# EAGLE design hdmi_receiver (EAGLE 5.05)

## Sheet 1 of 2
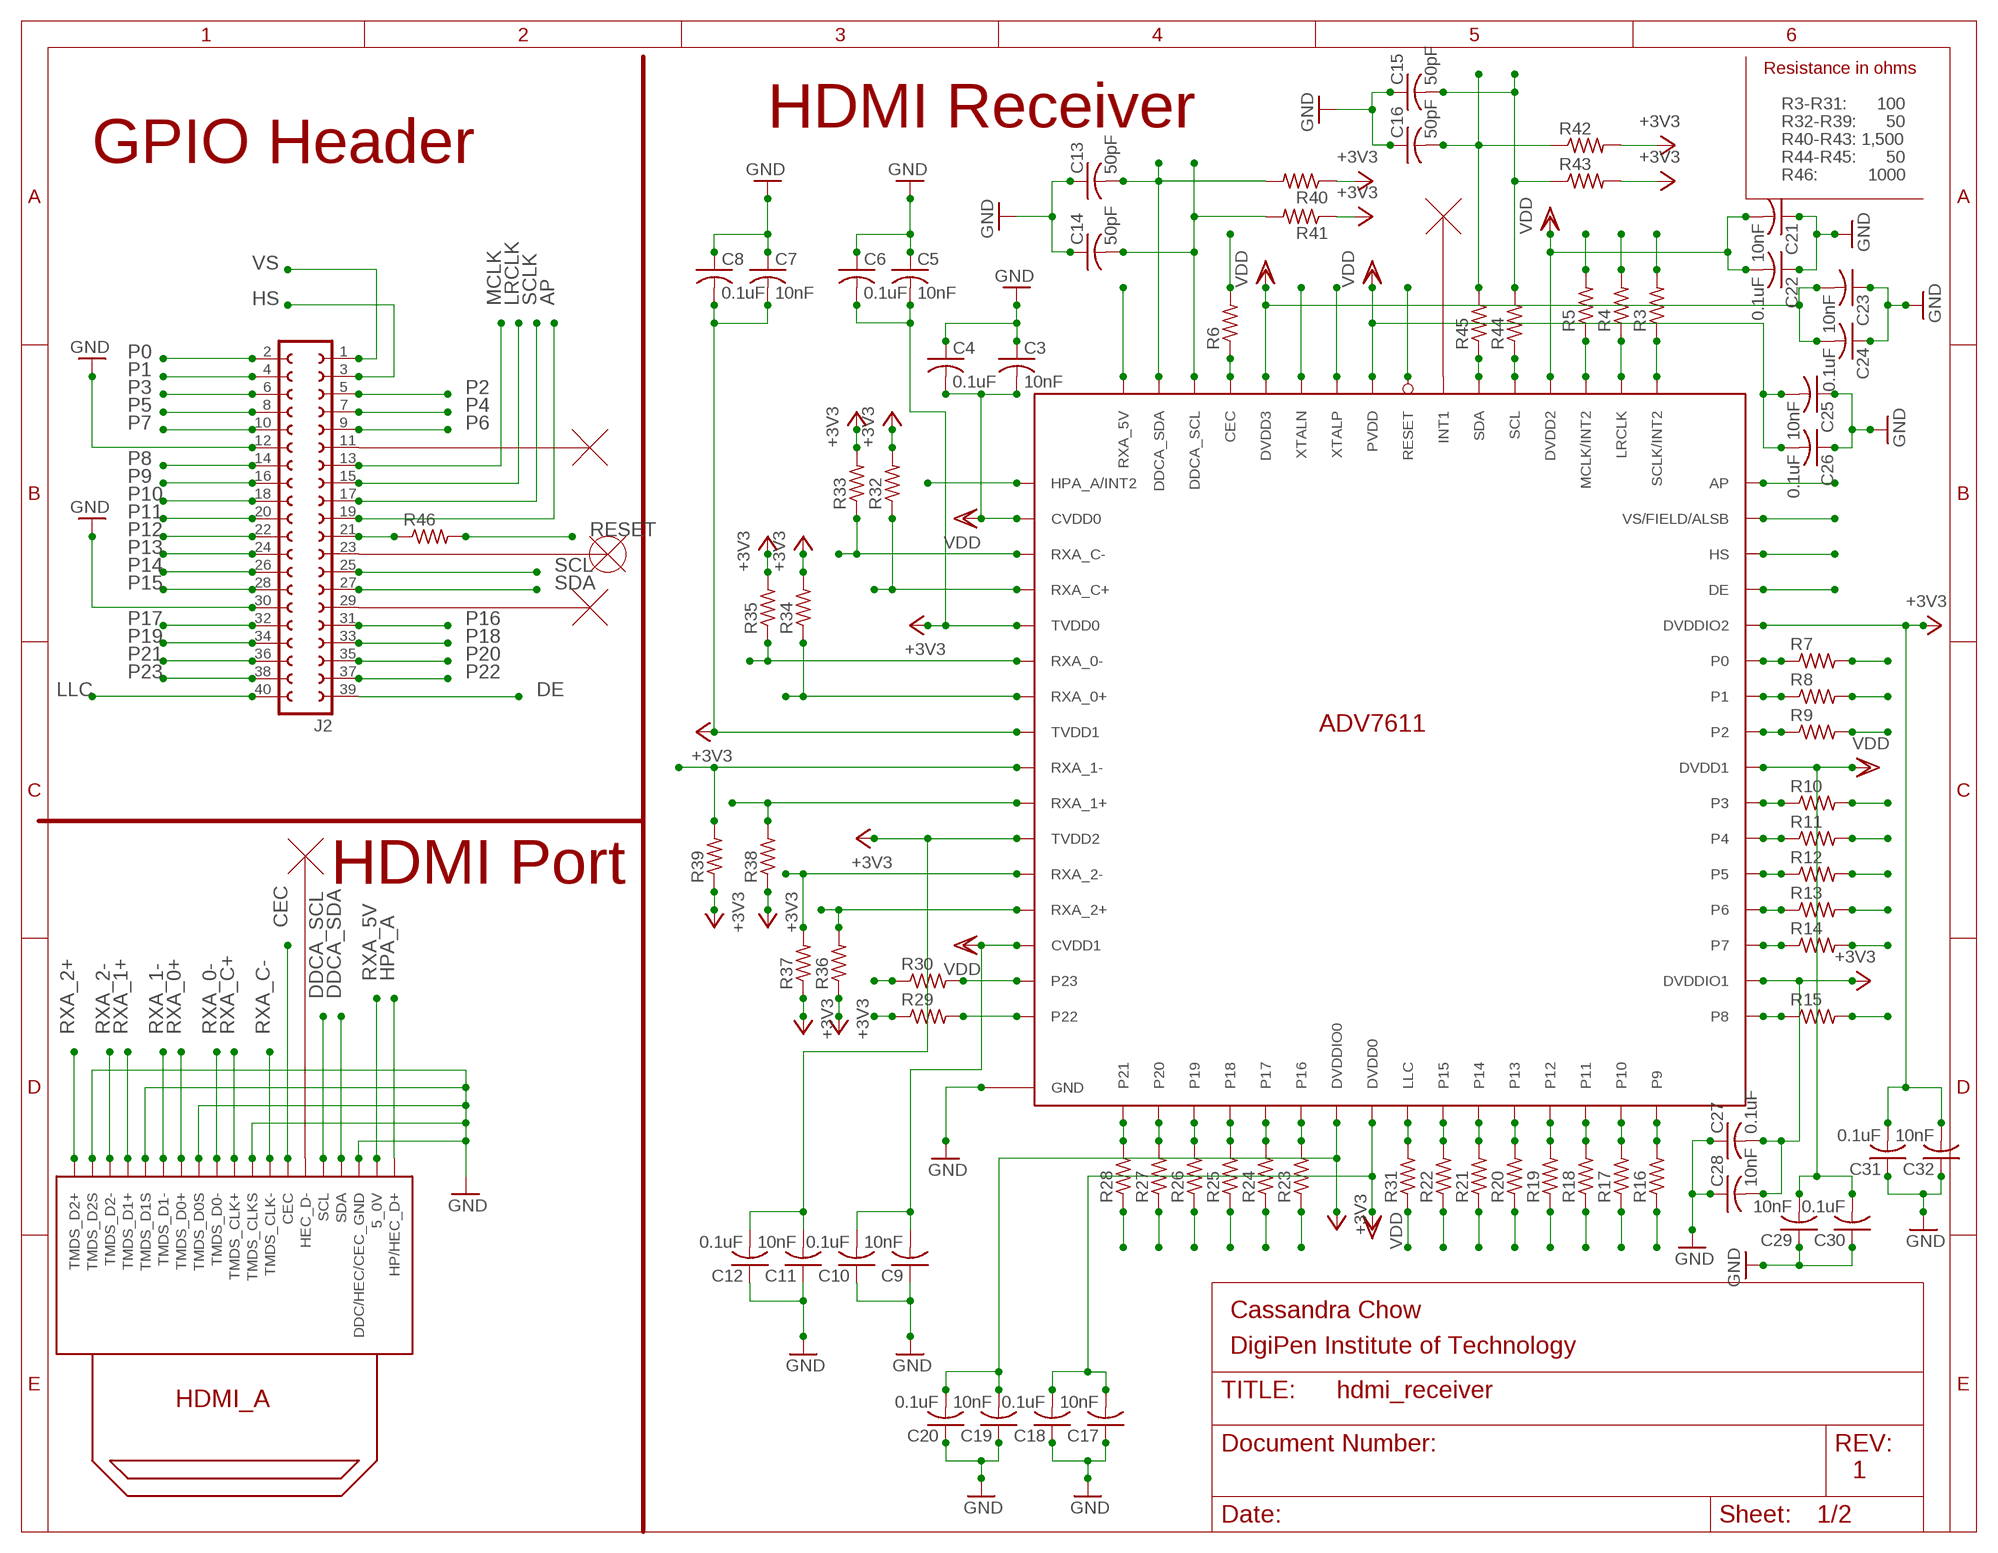
[diagram p0: schematic, sheet 1]

### Parts
ADV7611  ADV7611  [LQFP-ST-64-2]
C3  10nF  C-USC0603  [C0603]
C4  0.1uF  C-USC0603  [C0603]
C5  10nF  C-USC0603  [C0603]
C6  0.1uF  C-USC0603  [C0603]
C7  10nF  C-USC0603  [C0603]
C8  0.1uF  C-USC0603  [C0603]
C9  10nF  C-USC0603  [C0603]
C10  0.1uF  C-USC0603  [C0603]
C11  10nF  C-USC0603  [C0603]
C12  0.1uF  C-USC0603  [C0603]
C13  50pF  C-USC0603  [C0603]
C14  50pF  C-USC0603  [C0603]
C15  50pF  C-USC0603  [C0603]
C16  50pF  C-USC0603  [C0603]
C17  10nF  C-USC0603  [C0603]
C18  0.1uF  C-USC0603  [C0603]
C19  10nF  C-USC0603  [C0603]
C20  0.1uF  C-USC0603  [C0603]
C21  10nF  C-USC0603  [C0603]
C22  0.1uF  C-USC0603  [C0603]
C23  10nF  C-USC0603  [C0603]
C24  0.1uF  C-USC0603  [C0603]
C25  10nF  C-USC0603  [C0603]
C26  0.1uF  C-USC0603  [C0603]
C27  0.1uF  C-USC0603  [C0603]
C28  10nF  C-USC0603  [C0603]
C29  10nF  C-USC0603  [C0603]
C30  0.1uF  C-USC0603  [C0603]
C31  0.1uF  C-USC0603  [C0603]
C32  10nF  C-USC0603  [C0603]
J2  FE20-2  [FE20-2]
R3  R-US_R0603  [R0603]
R4  R-US_R0603  [R0603]
R5  R-US_R0603  [R0603]
R6  R-US_R0603  [R0603]
R7  R-US_R0603  [R0603]
R8  R-US_R0603  [R0603]
R9  R-US_R0603  [R0603]
R10  R-US_R0603  [R0603]
R11  R-US_R0603  [R0603]
R12  R-US_R0603  [R0603]
R13  R-US_R0603  [R0603]
R14  R-US_R0603  [R0603]
R15  R-US_R0603  [R0603]
R16  R-US_R0603  [R0603]
R17  R-US_R0603  [R0603]
R18  R-US_R0603  [R0603]
R19  R-US_R0603  [R0603]
R20  R-US_R0603  [R0603]
R21  R-US_R0603  [R0603]
R22  R-US_R0603  [R0603]
R23  R-US_R0603  [R0603]
R24  R-US_R0603  [R0603]
R25  R-US_R0603  [R0603]
R26  R-US_R0603  [R0603]
R27  R-US_R0603  [R0603]
R28  R-US_R0603  [R0603]
R29  R-US_R0603  [R0603]
R30  R-US_R0603  [R0603]
R31  R-US_R0603  [R0603]
R32  R-US_R0603  [R0603]
R33  R-US_R0603  [R0603]
R34  R-US_R0603  [R0603]
R35  R-US_R0603  [R0603]
R36  R-US_R0603  [R0603]
R37  R-US_R0603  [R0603]
R38  R-US_R0603  [R0603]
R39  R-US_R0603  [R0603]
R40  R-US_R0603  [R0603]
R41  R-US_R0603  [R0603]
R42  R-US_R0603  [R0603]
R43  R-US_R0603  [R0603]
R44  R-US_R0603  [R0603]
R45  R-US_R0603  [R0603]
R46  R-US_R0603  [R0603]
U$1  111RLF  [111RLF]

### Nets
+3V3: ADV7611.5(TVDD0) ADV7611.8(TVDD1) ADV7611.11(TVDD2) ADV7611.23(DVDDIO0) ADV7611.34(DVDDIO1) ADV7611.44(DVDDIO2) C5.2 C6.2 C7.2 C8.2 C11.2 C12.2 C19.2 C20.2 C27.2 C28.2 C31.2 C32.2 R32.2 R33.2 R34.2 R35.2 R36.1 R37.1 R38.1 R39.1 R40.1 R41.1 R42.2 R43.2 ; also sheet 2
AP: ADV7611.48(AP) J2.19
CEC: R6.2 U$1.13(CEC)
DDCA_SCL: ADV7611.62(DDCA_SCL) C14.2 R41.2 U$1.15(SCL)
DDCA_SDA: ADV7611.63(DDCA_SDA) C13.2 R40.2 U$1.16(SDA)
DE: ADV7611.45(DE) J2.39
GND: ADV7611.0(GND) C3.1 C4.1 C5.1 C6.1 C7.1 C8.1 C9.1 C10.1 C11.1 C12.1 C13.1 C14.1 C15.1 C16.1 C17.1 C18.1 C19.1 C20.1 C21.1 C22.1 C23.1 C24.1 C25.1 C26.1 C27.1 C28.1 C29.1 C30.1 C31.1 C32.1 J2.12 J2.30 U$1.2(TMDS_D2S) U$1.5(TMDS_D1S) U$1.8(TMDS_D0S) U$1.11(TMDS_CLKS) U$1.17(DDC/HEC/CEC_GND) ; also sheet 2
HPA_A: ADV7611.1(HPA_A/INT2) U$1.19(HP/HEC_D+)
HS: ADV7611.46(HS) J2.3
LLC: J2.40 R31.1
LRCLK: J2.15 R4.2
MCLK: J2.13 R5.2
N$1: ADV7611.25(LLC) R31.2
N$4: ADV7611.49(SCLK/INT2) R3.1
N$5: ADV7611.50(LRCLK) R4.1
N$6: ADV7611.51(MCLK/INT2) R5.1
N$7: ADV7611.61(CEC) R6.1
N$8: ADV7611.39(P3) R10.1
N$9: ADV7611.38(P4) R11.1
N$10: ADV7611.37(P5) R12.1
N$11: ADV7611.36(P6) R13.1
N$12: ADV7611.35(P7) R14.1
N$14: ADV7611.54(SDA) R45.1
N$15: ADV7611.53(SCL) R44.1
N$16: J2.21 R46.1
N$18: ADV7611.32(P9) R16.2
N$19: ADV7611.31(P10) R17.2
N$20: ADV7611.30(P11) R18.2
N$21: ADV7611.29(P12) R19.2
N$22: ADV7611.28(P13) R20.2
N$23: ADV7611.27(P14) R21.2
N$24: ADV7611.26(P15) R22.2
N$25: ADV7611.22(P16) R23.2
N$26: ADV7611.21(P17) R24.2
N$27: ADV7611.20(P18) R25.2
N$28: ADV7611.19 R26.2
N$29: ADV7611.18(P20) R27.2
N$30: ADV7611.17(P21) R28.2
N$44: ADV7611.16(P22) R29.2
N$45: ADV7611.15(P23) R30.2
N$48: ADV7611.33(P8) R15.1
N$49: ADV7611.41(P2) R9.1
N$51: ADV7611.42(P1) R8.1
N$52: ADV7611.43(P0) R7.1
P0: J2.2 R7.2
P1: J2.4 R8.2
P2: J2.5 R9.2
P3: J2.6 R10.2
P4: J2.7 R11.2
P5: J2.8 R12.2
P6: J2.9 R13.2
P7: J2.10 R14.2
P8: J2.14 R15.2
P9: J2.16 R16.1
P10: J2.18 R17.1
P11: J2.20 R18.1
P12: J2.22 R19.1
P13: J2.24 R20.1
P14: J2.26 R21.1
P15: J2.28 R22.1
P16: J2.31 R23.1
P17: J2.32 R24.1
P18: J2.33 R25.1
P19: J2.34 R26.1
P20: J2.35 R27.1
P21: J2.36 R28.1
P22: J2.37 R29.1
P23: J2.38 R30.1
RESET: ADV7611.56(RESET) R46.2 ; also sheet 2
RXA_0+: ADV7611.7(RXA_0+) R34.1 U$1.7(TMDS_D0+)
RXA_0-: ADV7611.6(RXA_0-) R35.1 U$1.9(TMDS_D0-)
RXA_1+: ADV7611.10(RXA_1+) R38.2 U$1.4(TMDS_D1+)
RXA_1-: ADV7611.9(RXA_1-) R39.2 U$1.6(TMDS_D1-)
RXA_2+: ADV7611.13(RXA_2+) R36.2 U$1.1(TMDS_D2+)
RXA_2-: ADV7611.12(RXA_2-) R37.2 U$1.3(TMDS_D2-)
RXA_5V: ADV7611.64(RXA_5V) U$1.18(5_0V)
RXA_C+: ADV7611.4(RXA_C+) R32.1 U$1.10(TMDS_CLK+)
RXA_C-: ADV7611.3(RXA_C-) R33.1 U$1.12(TMDS_CLK-)
SCL: C15.2 J2.25 R43.1 R44.2
SCLK: J2.17 R3.2
SDA: C16.2 J2.27 R42.1 R45.2
VDD: ADV7611.2(CVDD0) ADV7611.14(CVDD1) ADV7611.24(DVDD0) ADV7611.40(DVDD1) ADV7611.52(DVDD2) ADV7611.57(PVDD) ADV7611.60(DVDD3) C3.2 C4.2 C9.2 C10.2 C17.2 C18.2 C21.2 C22.2 C23.2 C24.2 C25.2 C26.2 C29.2 C30.2 ; also sheet 2
VS: ADV7611.47(VS/FIELD/ALSB) J2.1
XTALN: ADV7611.59(XTALN) ; also sheet 2
XTALP: ADV7611.58(XTALP) ; also sheet 2
Unconnected: ADV7611.55(INT1) J2.11 J2.23 J2.29 U$1.14(HEC_D-)

### Notes on the sheet
- Resistance in ohms
- R3-R31:      100
- HDMI Receiver | R32-R39:      50
- R40-R43: 1,500
- GPIO Header | R44-R45:      50
- R46:          1000
- VS
- HS | MCLK | LRCLK | SCLK | AP
- P0
- P1
- P3 | P2
- P5 | P4
- P7 | P6
- P8
- P9
- P10
- P11
- P12 | RESET
- P13
- P14 | SCL
- P15 | SDA
- P17 | P16
- P19 | P18
- P21 | P20
- P23 | P22
- LLC | DE
- HDMI Port
- CEC
- RXA_5V | HPA_A
- DDCA_SCL | DDCA_SDA
- RXA_2+ | RXA_2- | RXA_1+ | RXA_1- | RXA_0+ | RXA_0- | RXA_C+ | RXA_C-
- Cassandra Chow
- DigiPen Institute of Technology
- 1

## Sheet 2 of 2
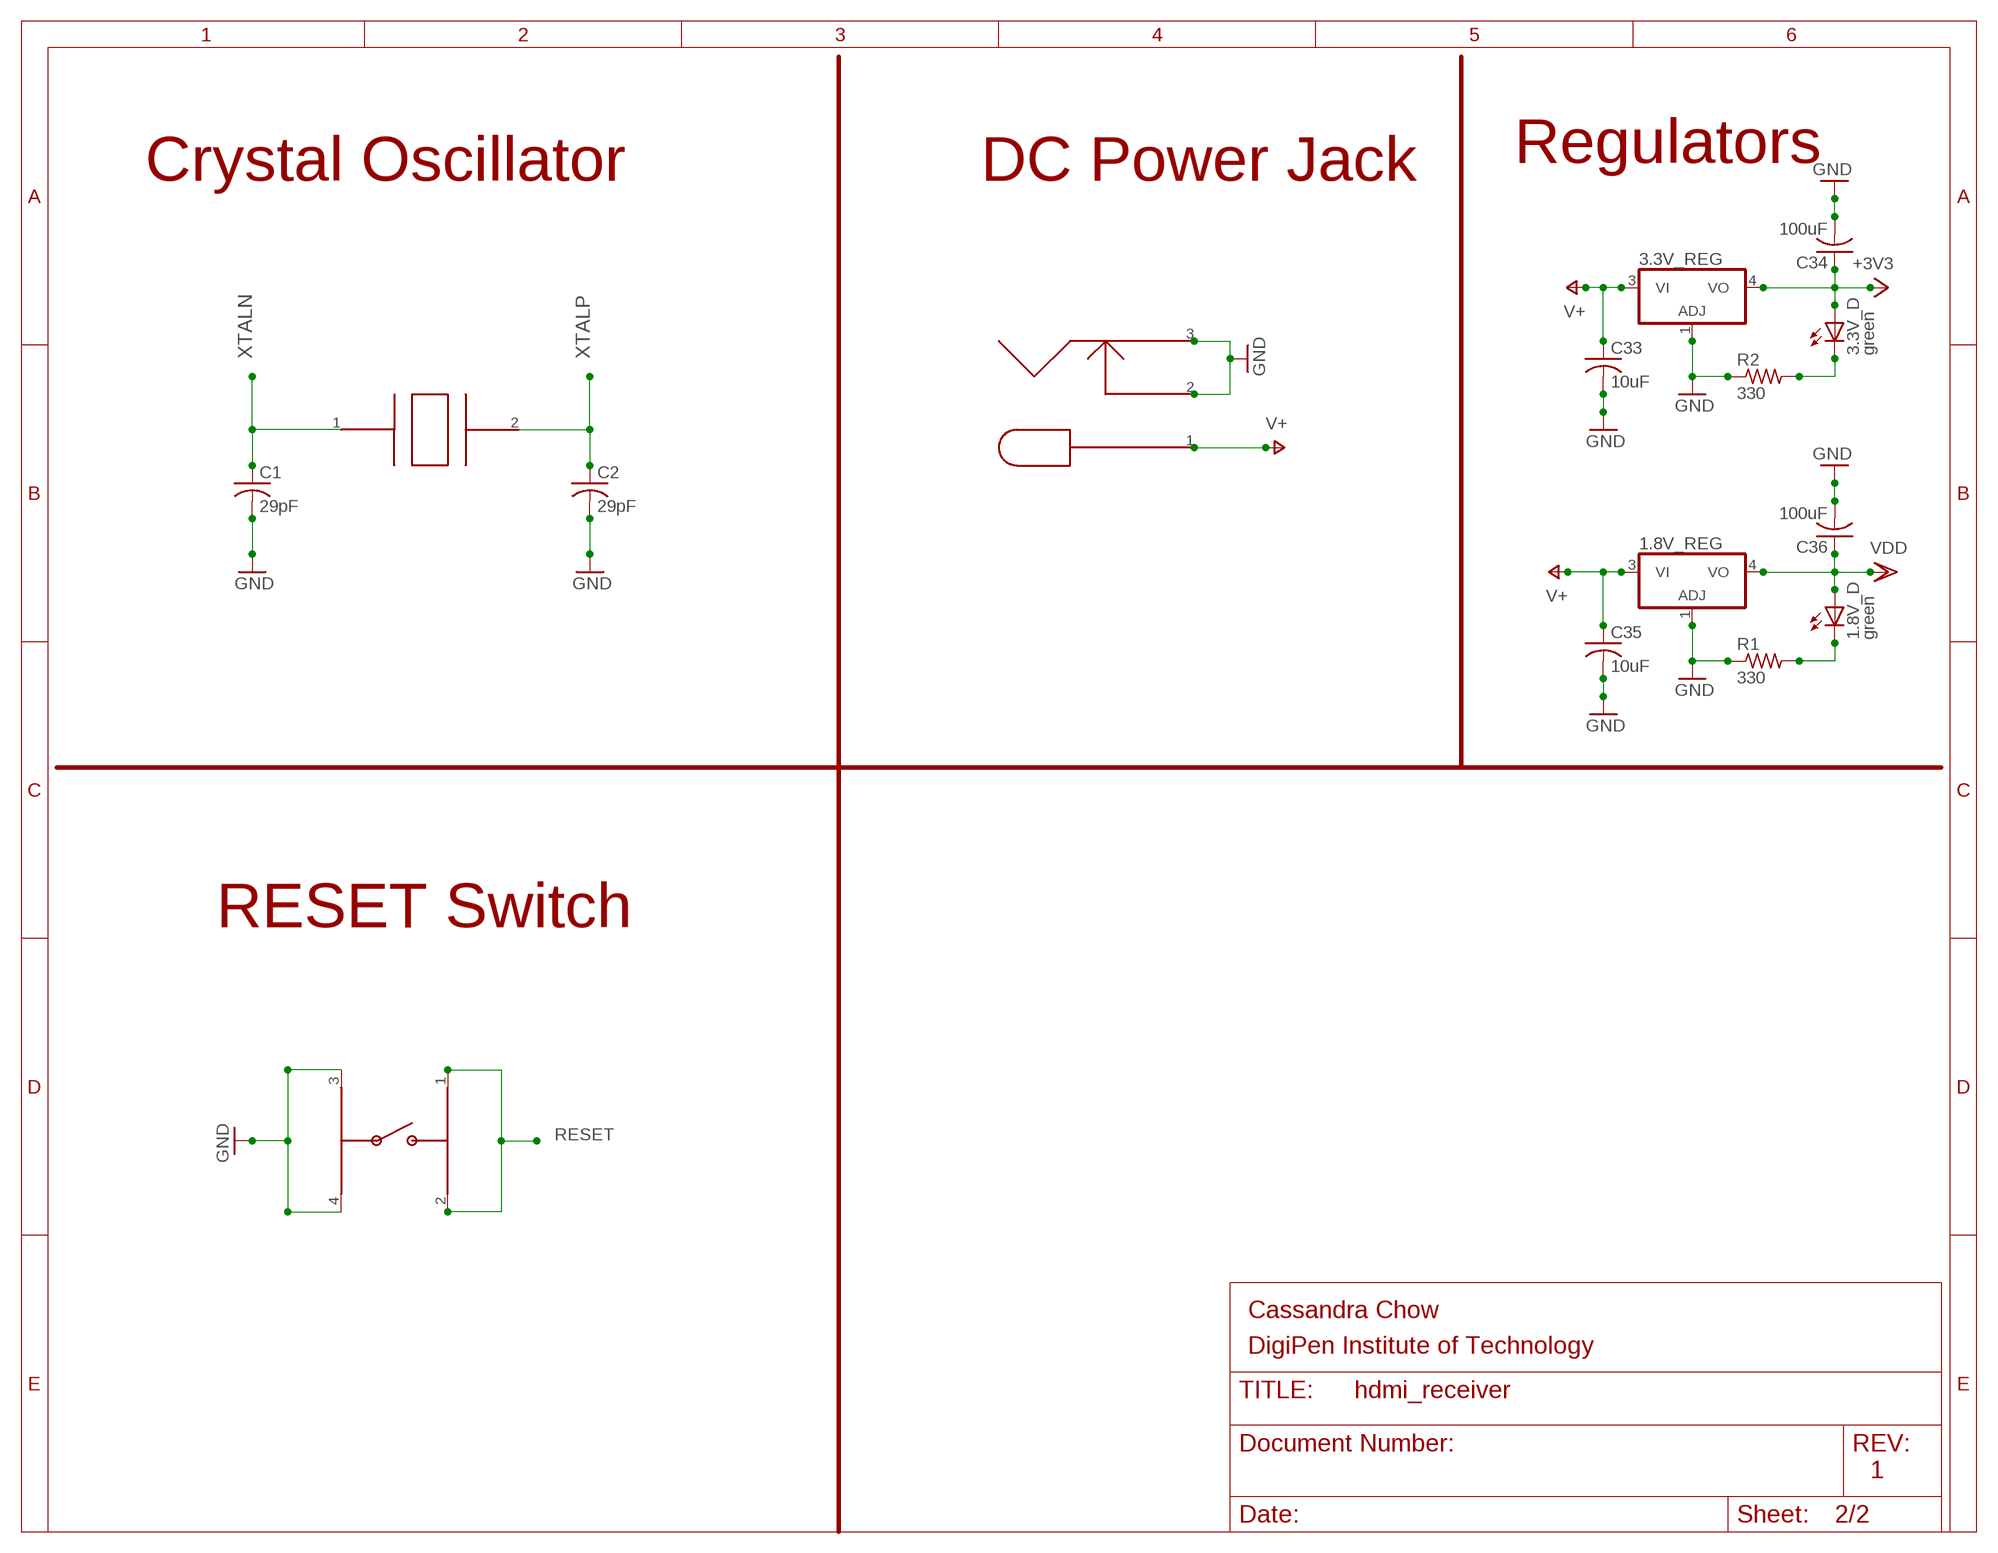
[diagram p1: schematic, sheet 2]

### Parts
1.8V_D  green  LED5MM  [LED5MM]
1.8V_REG  317EMP  [SOT223]
3.3V_D  green  LED5MM  [LED5MM]
3.3V_REG  317EMP  [SOT223]
C1  29pF  C-USC1210  [C1210]
C2  29pF  C-USC1210  [C1210]
C33  10uF  C-USC0603  [C0603]
C34  100uF  C-USC1206  [C1206]
C35  10uF  C-USC0603  [C0603]
C36  100uF  C-USC1206  [C1206]
R1  330  R-US_R0603  [R0603]
R2  330  R-US_R0603  [R0603]
U$2  CRYSTAL_OSC  [CRYSTAL_OSC]
U$3  CK_SWITCH  [CK_SWITCH]
U$4  DC_BARREL_CONN  [DC_BARREL_CONN]

### Nets
+3V3: 3.3V_D.A 3.3V_REG.4(VO) C34.1 ; also sheet 1
GND: 1.8V_REG.1(ADJ) 3.3V_REG.1(ADJ) C1.2 C2.2 C33.2 C34.2 C35.2 C36.2 R1.1 R2.1 U$3.3 U$3.4 U$4.2 U$4.3 ; also sheet 1
N$2: 1.8V_D.K(C) R1.2
N$3: 3.3V_D.K(C) R2.2
RESET: U$3.1 U$3.2 ; also sheet 1
V+: 1.8V_REG.3(VI) 3.3V_REG.3(VI) C33.1 C35.1 U$4.1
VDD: 1.8V_D.A 1.8V_REG.4(VO) C36.1 ; also sheet 1
XTALN: C1.1 U$2.1 ; also sheet 1
XTALP: C2.1 U$2.2 ; also sheet 1

### Notes on the sheet
- Crystal Oscillator | DC Power Jack | Regulators
- XTALN | XTALP
- RESET Switch
- RESET
- Cassandra Chow
- DigiPen Institute of Technology
- 1

## Library data of the parts
1.8V_D 3.3V_D = led:LED: LED OSRAM: - CHIPLED LG R971, LG N971, LY N971, LG Q971, LY Q971, LO R971, LY R971 LH N974, LH R974 LS Q976, LO Q976, LY Q976 LO Q996 - Hyper CHIPLED LW Q18S LB Q993, LB Q99A, LB R99A - SideLED LS A670, LO A670, LY A670, LG A670, LP A670 LB A673, LV A673, LT A673, LW A673 LH A674 LY A675 LS A676, LA A676, LO A676, LY A676, LW A676 LS A679, LY A679, LG A679 - Hyper Micro SIDELED® LS Y876, LA Y876, LO Y876, LY Y876 LT Y87S - SmartLED LW L88C, LW L88S LB L89C, LB L89S, LG L890 LS L89K, LO L89K, LY L89K LS L896, LA L896, LO L896, LY L896 - TOPLED LS T670, LO T670, LY T670, LG T670, LP T670 LSG T670, LSP T670, LSY T670, LOP T670, LYG T670 LG T671, LOG T671, LSG T671 LB T673, LV T673, LT T673, LW T673 LH T674 LS T676, LA T676, LO T676, LY T676, LB T676, LH T676, LSB T676, LW T676 LB T67C, LV T67C, LT T67C, LS T67K, LO T67K, LY T67K, LW E67C LS E67B, LA E67B, LO E67B, LY E67B, LB E67C, LV E67C, LT E67C LW T67C LS T679, LY T679, LG T679 LS T770, LO T770, LY T770, LG T770, LP T770 LB T773, LV T773, LT T773, LW T773 LH T774 LS E675, LA E675, LY E675, LS T675 LS T776, LA T776, LO T776, LY T776, LB T776 LHGB T686 LT T68C, LB T68C - Hyper Mini TOPLED® LB M676 - Mini TOPLED Santana® LG M470 LS M47K, LO M47K, LY M47K Source: http://www.osram.convergy.de LUXEON: - LUMILED® LXK2-PW12-R00, LXK2-PW12-S00, LXK2-PW14-U00, LXK2-PW14-V00 LXK2-PM12-R00, LXK2-PM12-S00, LXK2-PM14-U00 LXK2-PE12-Q00, LXK2-PE12-R00, LXK2-PE12-S00, LXK2-PE14-T00, LXK2-PE14-U00 LXK2-PB12-K00, LXK2-PB12-L00, LXK2-PB12-M00, LXK2-PB14-N00, LXK2-PB14-P00, LXK2-PB14-Q00 LXK2-PR12-L00, LXK2-PR12-M00, LXK2-PR14-Q00, LXK2-PR14-R00 LXK2-PD12-Q00, LXK2-PD12-R00, LXK2-PD12-S00 LXK2-PH12-R00, LXK2-PH12-S00 LXK2-PL12-P00, LXK2-PL12-Q00, LXK2-PL12-R00 Source: www.luxeon.com KINGBRIGHT: KA-3528ASYC Source: www.kingbright.com
1.8V_REG 3.3V_REG = linear:*317: Positive VOLTAGE REGULATOR
ADV7611 = cchow_2014:ADV7611
C1-C36 = rcl:C-US: CAPACITOR, American symbol
J2 = con-lsta:FE20-2: FEMALE HEADER
R1-R46 = resistor:R-US_: RESISTOR, American symbol
U$1 = cchow_2014:111RLF
U$2 = cchow_2014:CRYSTAL_OSC
U$3 = cchow_2014:CK_SWITCH
U$4 = cchow_2014:DC_BARREL_CONN

## Board
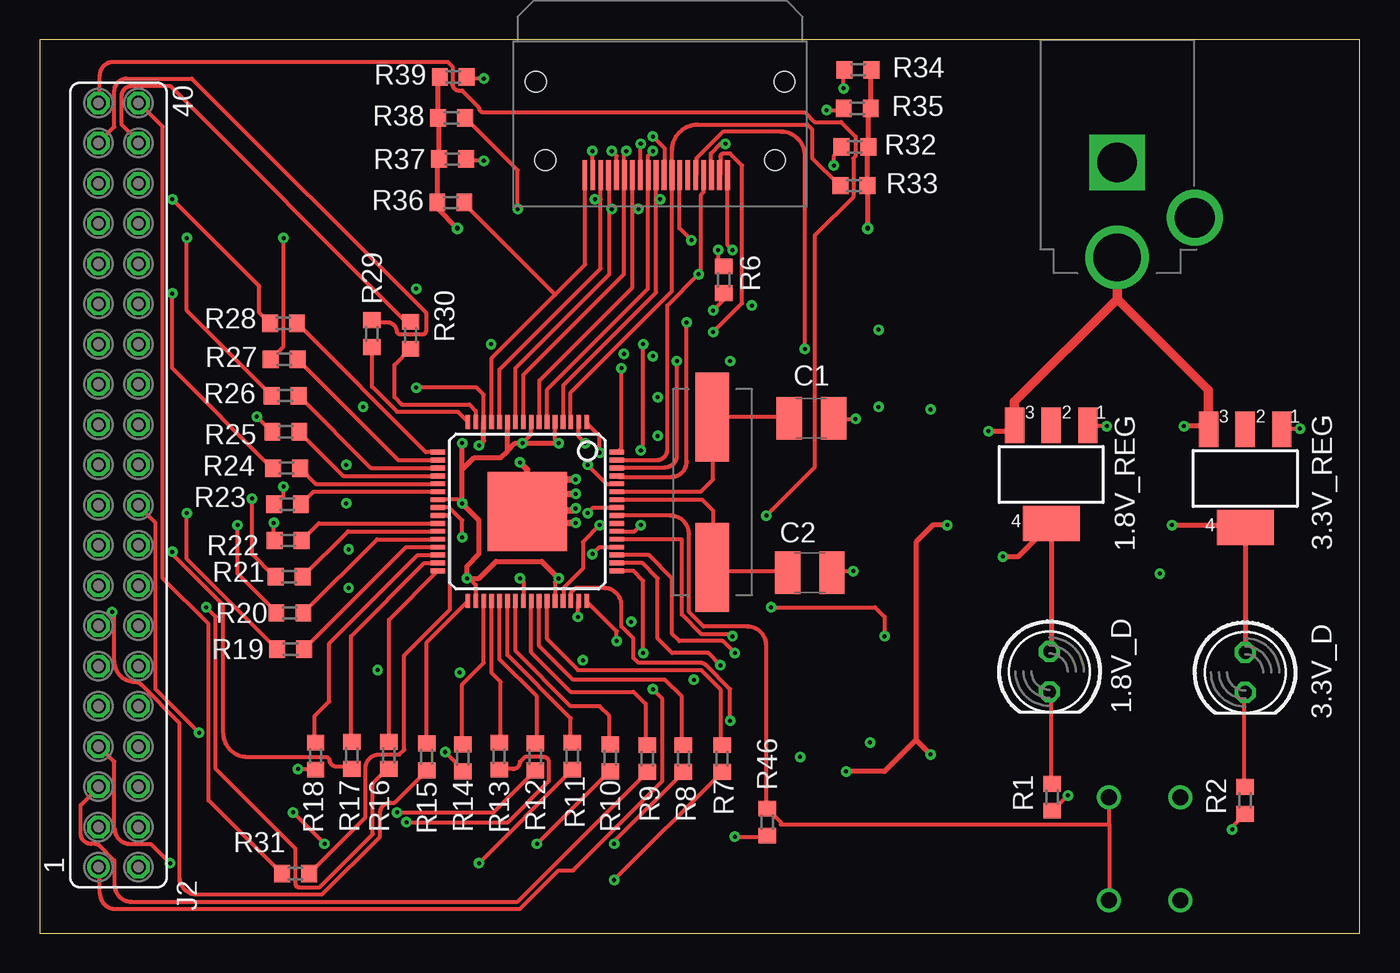
[diagram p2: board, top side]
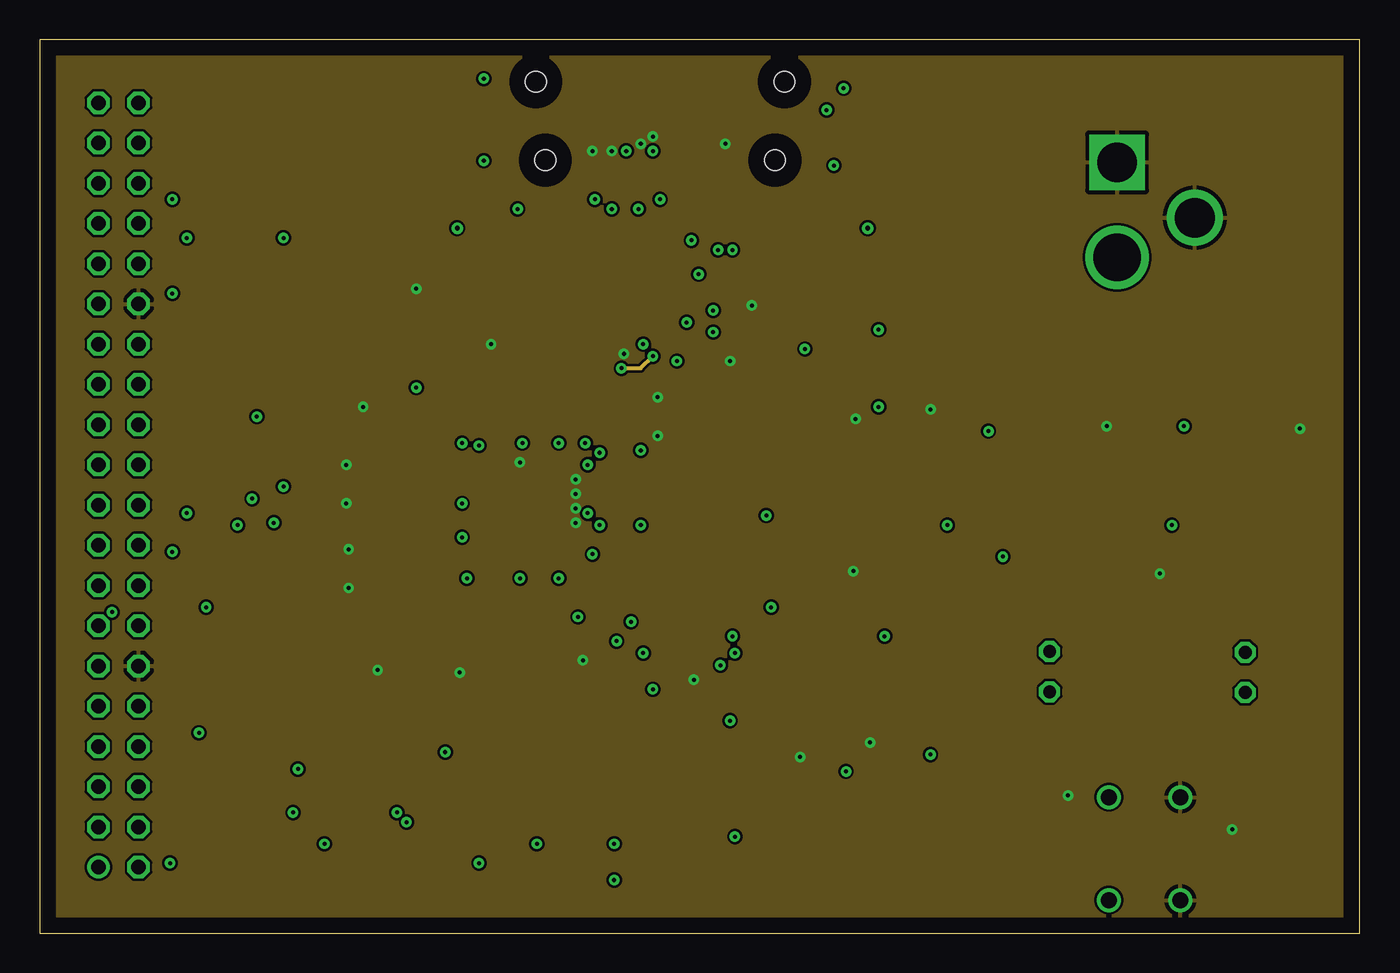
[diagram p3: board, inner layer Route2]
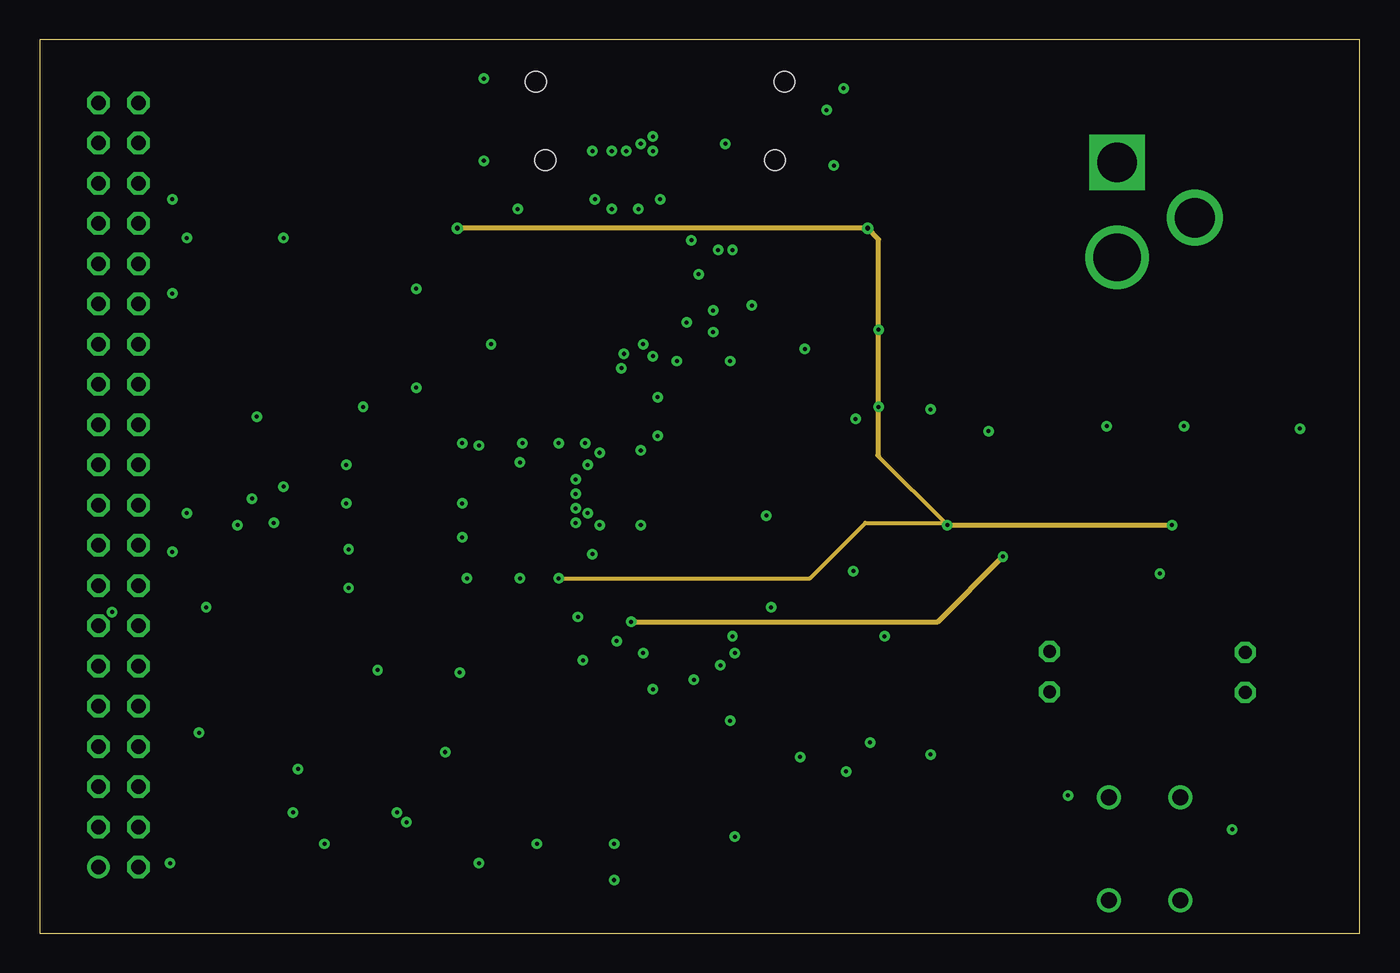
[diagram p4: board, inner layer Route3]
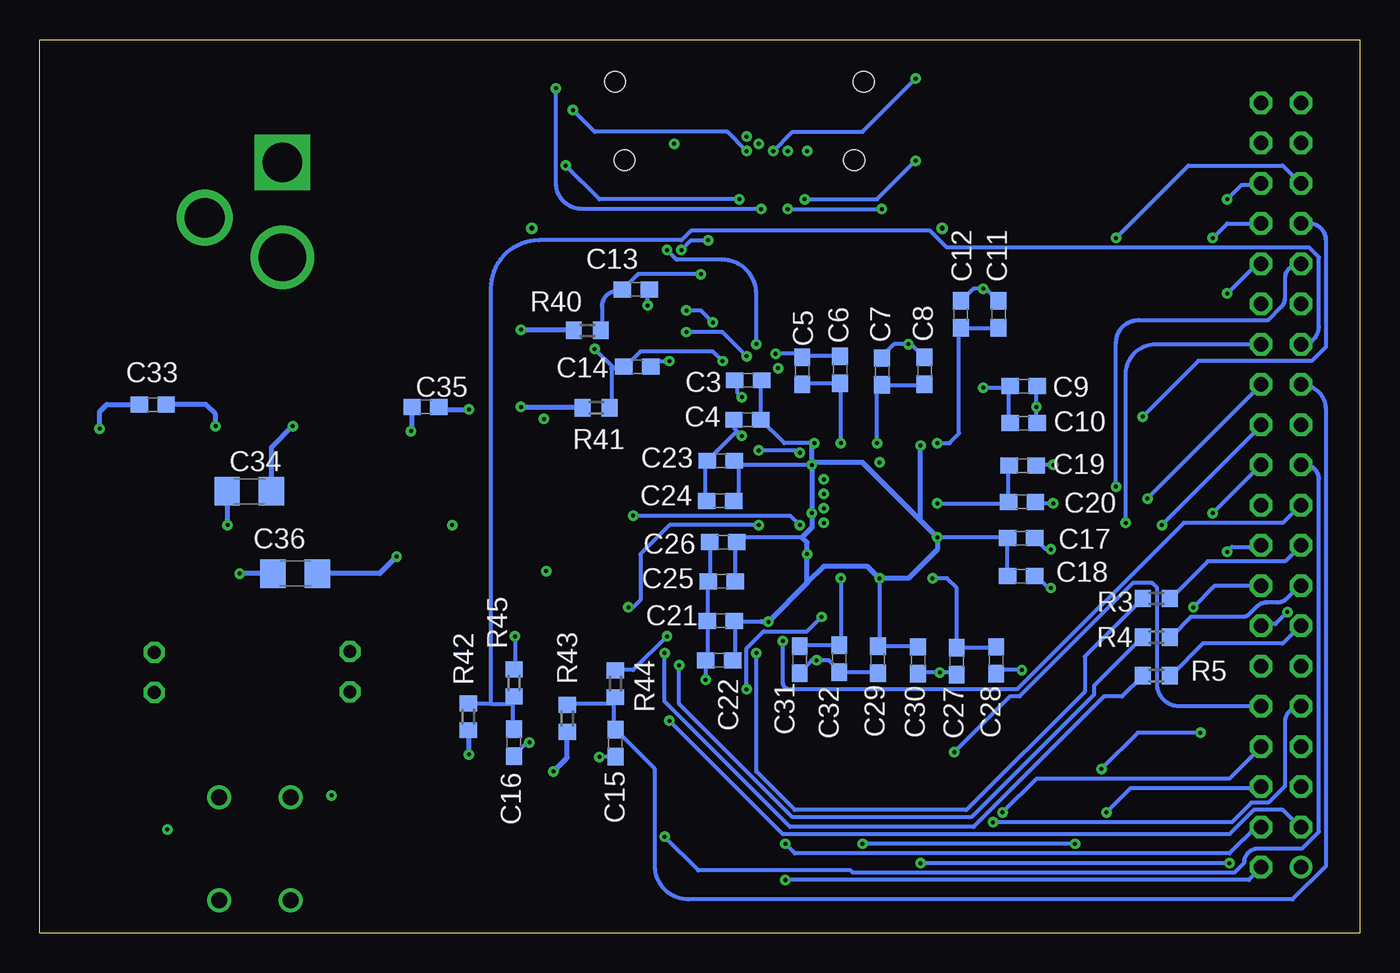
[diagram p5: board, bottom side, seen from below]

Size 83.34 x 56.41 mm. Coordinates in mm from the lower left corner, seen from the top.
Outline: 0,0 83.34,0 83.34,56.41 0,56.41 0,0
Copper layers (1*2*3*16): Top 0.035mm / dielectric 0.2286mm / Route2 0.035mm / dielectric 0.9906mm / Route3 0.035mm / dielectric 0.2286mm / Bottom 0.035mm
Design rules "default *": minimum track width 10mil, minimum drill 10mil, track to track 6mil, track to pad 6mil, pad to pad 6mil, via to via 6mil, smd to smd 6mil, copper to edge 40mil, drill to drill 10mil, minimum pad ring 10mil, minimum via ring 8mil, stop-mask expansion 4mil, vias tented up to drill 0mil, thermal gap 10mil
vRestrict: area 39.6,20.1 to 45.4,35.7

### Footprints (pad centres in the part's own frame; a part is rotated, then mirrored left to right if it is on the bottom)
LED5MM = drill 0.813 octagon: A -1.27,0; K 1.27,0
SOT223 = smd 1.219 x 2.235: 1 -2.311,-3.099; 2 0,-3.099; 3 2.311,-3.099 | smd 3.6 x 2.2: 4 0,3.099
LQFP-ST-64-2 = smd 5 x 5: 0 0,0 | smd 0.9 x 0.3: 1 -5.65,3.75; 2 -5.65,3.25; 3 -5.65,2.75; 4 -5.65,2.25; 5 -5.65,1.75; 6 -5.65,1.25; 7 -5.65,0.75; 8 -5.65,0.25; 9 -5.65,-0.25; 10 -5.65,-0.75; 11 -5.65,-1.25; 12 -5.65,-1.75; 13 -5.65,-2.25; 14 -5.65,-2.75; 15 -5.65,-3.25; 16 -5.65,-3.75; 33 5.65,-3.75; 34 5.65,-3.25; 35 5.65,-2.75; 36 5.65,-2.25; 37 5.65,-1.75; 38 5.65,-1.25; 39 5.65,-0.75; 40 5.65,-0.25; 41 5.65,0.25; 42 5.65,0.75; 43 5.65,1.25; 44 5.65,1.75; 45 5.65,2.25; 46 5.65,2.75; 47 5.65,3.25; 48 5.65,3.75 | smd 0.3 x 0.9: 17 -3.75,-5.65; 18 -3.25,-5.65; 19 -2.75,-5.65; 20 -2.25,-5.65; 21 -1.75,-5.65; 22 -1.25,-5.65; 23 -0.75,-5.65; 24 -0.25,-5.65; 25 0.25,-5.65; 26 0.75,-5.65; 27 1.25,-5.65; 28 1.75,-5.65; 29 2.25,-5.65; 30 2.75,-5.65; 31 3.25,-5.65; 32 3.75,-5.65; 49 3.75,5.65; 50 3.25,5.65; 51 2.75,5.65; 52 2.25,5.65; 53 1.75,5.65; 54 1.25,5.65; 55 0.75,5.65; 56 0.25,5.65; 57 -0.25,5.65; 58 -0.75,5.65; 59 -1.25,5.65; 60 -1.75,5.65; 61 -2.25,5.65; 62 -2.75,5.65; 63 -3.25,5.65; 64 -3.75,5.65
C1210 = smd 1.6 x 2.7: 1 -1.4,0; 2 1.4,0
C0603 = smd 1.1 x 1: 1 -0.85,0; 2 0.85,0
C1206 = smd 1.6 x 1.8: 1 -1.4,0; 2 1.4,0
FE20-2 = drill 0.914 round: 1 -24.13,1.27 | drill 0.914 octagon: 2 -24.13,-1.27; 3 -21.59,1.27; 4 -21.59,-1.27; 5 -19.05,1.27; 6 -19.05,-1.27; 7 -16.51,1.27; 8 -16.51,-1.27; 9 -13.97,1.27; 10 -13.97,-1.27; 11 -11.43,1.27; 12 -11.43,-1.27; 13 -8.89,1.27; 14 -8.89,-1.27; 15 -6.35,1.27; 16 -6.35,-1.27; 17 -3.81,1.27; 18 -3.81,-1.27; 19 -1.27,1.27; 20 -1.27,-1.27; 21 1.27,1.27; 22 1.27,-1.27; 23 3.81,1.27; 24 3.81,-1.27; 25 6.35,1.27; 26 6.35,-1.27; 27 8.89,1.27; 28 8.89,-1.27; 29 11.43,1.27; 30 11.43,-1.27; 31 13.97,1.27; 32 13.97,-1.27; 33 16.51,1.27; 34 16.51,-1.27; 35 19.05,1.27; 36 19.05,-1.27; 37 21.59,1.27; 38 21.59,-1.27; 39 24.13,1.27; 40 24.13,-1.27
R0603 = smd 1 x 1.1: 1 -0.85,0; 2 0.85,0
111RLF = smd 0.3 x 1.9: 1 4.75,0; 2 4.25,0; 3 3.75,0; 4 3.25,0; 5 2.75,0; 6 2.25,0; 7 1.75,0; 8 1.25,0; 9 0.75,0; 10 0.25,0; 11 -0.25,0; 12 -0.75,0; 13 -1.25,0; 14 -1.75,0; 15 -2.25,0; 16 -2.75,0; 17 -3.25,0; 18 -3.75,0; 19 -4.25,0 | hole 1.3: -7.25,-0.95; 7.25,-0.95; -7.85,-5.9; 7.85,-5.9
CRYSTAL_OSC = smd 5.6 x 2.1: 1 -4.75,0; 2 4.75,0
CK_SWITCH = drill 1 round: 1 -3.25,2.25; 2 3.25,2.25; 3 -3.25,-2.25; 4 3.25,-2.25
DC_BARREL_CONN = drill 3 round: 1 6,0 | drill 2.5 round: 2 3.5,4.9 | drill 2.5 square: 3 0,0

### Placement (x,y rotation side)
1.8V_D  63.75,16.51 270 top
1.8V_REG  63.86,28.96 180 top
3.3V_D  76.1,16.46 270 top
3.3V_REG  76.1,28.7 180 top
ADV7611  30.78,26.62 270 top
C1  48.72,32.51 0 top
C2  48.62,22.76 0 top
C3  38.61,34.9 0 bottom
C4  38.66,32.41 0 bottom
C5  35.2,35.51 270 bottom
C6  32.82,35.56 270 bottom
C7  30.18,35.46 270 bottom
C8  27.48,35.51 270 bottom
C9  21.23,34.54 180 bottom
C10  21.23,32.21 180 bottom
C11  22.81,39.07 270 bottom
C12  25.2,39.07 270 bottom
C13  45.72,40.64 180 bottom
C14  45.62,35.76 180 bottom
C15  46.99,11.99 90 bottom
C16  53.39,12.04 90 bottom
C17  21.39,24.94 180 bottom
C18  21.39,22.56 180 bottom
C19  21.29,29.51 180 bottom
C20  21.34,27.23 180 bottom
C21  40.34,19.71 0 bottom
C22  40.44,17.22 0 bottom
C23  40.34,29.82 0 bottom
C24  40.39,27.28 0 bottom
C25  40.28,22.2 0 bottom
C26  40.18,24.69 0 bottom
C27  25.45,17.17 90 bottom
C28  22.96,17.22 90 bottom
C29  30.43,17.27 90 bottom
C30  27.89,17.22 90 bottom
C31  35.36,17.27 90 bottom
C32  32.87,17.32 90 bottom
C33  76.2,33.38 180 bottom
C34  70.1,27.89 0 bottom
C35  58.98,33.22 0 bottom
C36  67.21,22.71 180 bottom
J2  4.98,28.3 90 top
R1  63.91,8.59 90 top
R2  76.1,8.38 90 top
R3  12.85,21.13 0 bottom
R4  12.85,18.69 0 bottom
R5  12.85,16.26 0 bottom
R6  43.18,41.25 90 top
R7  43.08,11.02 270 top
R8  40.64,11.02 270 top
R9  38.35,11.02 270 top
R10  36.02,11.07 270 top
R11  33.63,11.18 270 top
R12  31.29,11.13 270 top
R13  29.01,11.18 270 top
R14  26.72,11.07 270 top
R15  24.43,11.13 270 top
R16  22.05,11.23 90 top
R17  19.71,11.23 90 top
R18  17.42,11.18 90 top
R19  15.85,17.93 0 top
R20  15.8,20.22 0 top
R21  15.75,22.5 0 top
R22  15.7,24.79 0 top
R23  15.65,27.08 0 top
R24  15.6,29.36 0 top
R25  15.54,31.65 0 top
R26  15.49,33.93 0 top
R27  15.44,36.22 0 top
R28  15.39,38.51 0 top
R29  20.98,37.85 270 top
R30  23.42,37.74 270 top
R31  16.15,3.76 0 top
R32  51.46,49.63 0 top
R33  51.41,47.19 0 top
R34  51.66,54.51 0 top
R35  51.61,52.07 0 top
R36  25.96,46.13 0 top
R37  26.06,48.87 0 top
R38  26.01,51.46 0 top
R39  26.11,54.05 0 top
R40  48.77,38.05 0 bottom
R41  48.21,33.17 0 bottom
R42  56.29,13.67 270 bottom
R43  50.04,13.56 270 bottom
R44  46.99,15.75 270 bottom
R45  53.39,15.8 270 bottom
R46  45.92,7.01 90 top
U$1  39.17,47.85 180 top
U$2  42.47,27.84 270 top
U$3  69.75,5.33 90 top
U$4  68.02,48.67 270 top

### Tracks (layer width: path | path; a pad name or v marks a point on that pad's centre or on a via)
+3V3  (via drill 0.25, 0.3)
  Top 0.254: ADV7611.5 32.53,31.17 v32.77,30.94 | ADV7611.8 31.04,31.49 v30.48,30.94 | v26.98,22.4 27.13,22.4 27.54,22 ADV7611.34 | v52.27,44.5 52.26,44.51 | ADV7611.44 32.53,22.17 v32.77,22.4 | ADV7611.23 26.43,27.37 v26.67,27.13
  Top 0.305: 3.3V_D.A 3.3V_REG.4 75.95,25.76 v71.48,25.76 | 27.13,22.4 27.74,22.4 28.8,23.47 31.7,23.47 v32.77,22.4 | v26.98,22.4 26.98,23.16 27.74,23.93 27.74,26.06 v26.67,27.13 26.67,29.26 | v32.77,30.94 v30.48,30.94 30.02,30.94 29.54,30.45 | v52.27,44.5 52.27,47.18 R33.2 52.26,49.58 R32.2 52.31,51.92 R35.2 52.46,54.46 R34.2 | v26.36,44.5 25.11,45.76 R36.1 25.11,48.77 R37.1 25.21,51.41 R38.1 25.16,53.95 R39.1 | v57.3,25.76 56.39,25.76 55.32,24.69 55.32,12.19 | 55.32,12.19 v56.24,11.28 | v50.9,10.21 53.34,10.21 55.32,12.19 | 26.67,29.26 v26.67,30.94 | 26.67,29.26 27.43,30.02 29.11,30.02 29.54,30.45 | 29.54,30.45 ADV7611.11
  Route3 0.254: 52.88,30.18 52.96,30.1 v57.3,25.76 57.15,25.91 52.12,25.91 48.62,22.4 v32.77,22.4
  Route3 0.305: v57.3,25.76 v71.48,25.76 | 52.96,30.1 v52.96,33.22 v52.96,38.1 52.96,43.81 v52.27,44.5 v26.36,44.5
  Bottom 0.254: C5.2 35.15,34.71 C6.2 32.77,34.66 v32.77,30.94 | v30.48,30.94 30.48,34.3 C7.2 27.53,34.61 C8.2 | C11.2 C12.2 25.3,38.11 25.3,31.55 25.91,30.94 v26.67,30.94 | v26.67,27.13 22.29,27.13 C20.2 22.19,29.46 C19.2 | v26.98,22.4 26.06,22.4 25.45,21.79 C27.2 23.01,18.02 C28.2 | C31.2 35.31,18.17 C32.2 32.77,18.27 v32.77,22.4
  Bottom 0.305: v56.24,11.28 56.24,12.76 R42.2 | R43.2 50.04,11.07 v50.9,10.21 | R40.1 49.67,38.1 v52.96,38.1 | R41.1 49.11,33.22 v52.96,33.22 | v71.48,25.76 71.48,27.86 C34.1
AP  (via drill 0.25)
  Top 0.254: v36.42,18.44 36.42,19.05 34.59,20.88 ADV7611.48
  Bottom 0.254: v36.42,18.44 36.42,15.82 arc-90 35.99,15.39 21.64,15.39 11.12,25.91 4.88,25.91 3.81,26.98 J2.19
CEC  (via drill 0.25)
  Top 0.254: v42.82,43.13 42.82,42.52 43.13,42.22 R6.2 | v41.15,43.74 40.39,44.5 40.39,47.85 U$1.13
  Bottom 0.254: v42.82,43.13 42.22,43.74 v41.15,43.74
DDCA_SCL  (via drill 0.25)
  Top 0.254: v40.23,36.12 40.23,30.18 arc-90 39.47,29.41 36.58,29.41 ADV7611.62 | v48.31,36.88 48.31,49.09 arc90 46.8,50.6 43.13,50.6 41.45,48.92 41.45,47.85 U$1.15
  Bottom 0.254: v40.23,36.12 40.84,36.73 45.41,36.73 46.33,35.81 C14.2 46.48,35.66 47.09,35.66 | 47.09,35.66 47.24,35.66 47.24,33.22 R41.2 | 47.09,35.66 v48.31,36.88
DDCA_SDA  (via drill 0.25)
  Top 0.254: ADV7611.63 36.58,29.87 38.98,29.87 arc90 39.62,30.52 39.62,39.62 v41.6,41.6 41.76,41.76 41.76,46.63 41.91,46.79 U$1.16
  Bottom 0.254: R40.2 47.85,38.1 47.85,39.56 arc90 46.88,40.54 46.63,40.54 C13.2 46.48,40.69 45.57,41.6 v41.6,41.6
DE  (via drill 0.25)
  Top 0.254: v35.36,25.76 34.29,24.69 34.29,23.01 33.07,21.79 33.07,21.03 ADV7611.45 | v45.87,26.36 48.92,29.41 48.92,44.04 51.36,46.48 51.36,48.92 51.51,49.07 51.51,50.29 50.6,51.21 48.92,51.21 48.31,51.82 28.04,51.82 arc-90 27.74,52.12 26.67,53.19 26.49,53.19 arc-90 26.06,53.62 26.06,54.71 25.76,55.02 4.67,55.02 arc90 3.81,54.15 3.81,52.43 J2.39
  Bottom 0.254: v35.36,25.76 35.97,26.36 v45.87,26.36
GND  (via drill 0.25)
  Top 0.254: v64.92,8.69 64.01,7.77 R1.1 | v75.29,6.55 75.29,6.71 76.05,7.47 R2.1 | v34.9,49.38 34.9,47.85 U$1.2 | v36.12,49.38 36.42,49.07 U$1.5 | v37.95,49.84 37.95,47.85 U$1.8 | v38.71,50.29 39.47,49.53 39.47,47.85 U$1.11 | v43.28,49.84 42.98,49.84 42.37,49.23 42.37,47.85 U$1.17 | v67.36,32 66.29,32 1.8V_REG.1 | v79.55,31.85 78.49,31.85 3.3V_REG.1 | v51.36,22.86 50.14,22.86 C2.2 | v51.51,32.46 50.14,32.46 C1.2
  Top 0.406: v30.33,29.72 30.79,29.26 30.79,26.67 | ADV7611.0 30.79,26.67 | v33.83,28.65 32.77,28.65 30.79,26.67 | 30.79,26.67 31.85,27.74 v33.83,27.74 | v33.83,26.82 33.68,26.67 30.79,26.67 | v33.83,25.91 31.55,25.91 30.79,26.67
  Bottom 0.254: C26.1 41,24.69 41,22.25 C25.1 41.15,22.1 41.15,19.81 C21.1 41.15,19.66 41.15,17.22 C22.1 v41.3,16 | C29.1 30.48,16.46 32.77,16.46 C32.1 32.92,16.61 33.53,17.22 v34.29,17.22 34.59,17.22 35.36,16.46 C31.1 | v19.51,21.79 19.66,21.79 20.42,22.55 C18.1 | v19.51,24.23 19.81,24.23 20.42,24.84 C17.1 | v19.36,27.13 20.42,27.13 C20.1 | v19.36,29.57 20.42,29.57 C19.1 | C10.1 20.42,32.31 v20.42,33.22 20.42,34.44 C9.1 | v21.34,16.61 22.71,16.61 22.86,16.46 C28.1 | C27.1 25.45,16.46 v26.52,16.46 27.89,16.46 C30.1 | C4.1 39.47,32.31 39.47,31.85 v39.01,31.39 39.32,31.55 39.47,31.55 41.15,29.87 C23.1 41.3,29.72 41.3,27.28 C24.1 | C11.1 22.86,39.93 23.62,40.69 v23.77,40.69 24.38,40.69 25.15,39.93 C12.1 | v39.01,33.83 39.32,34.14 39.32,34.9 C3.1 | v43.59,36.12 44.35,36.12 44.65,35.81 C14.1 | C8.1 27.58,36.42 28.35,37.19 v28.5,37.19 29.41,37.19 30.18,36.42 C7.1 | 35.2,36.42 35.36,36.58 v36.88,36.58 | 35.2,36.42 32.92,36.42 C6.1 | 35.2,36.42 C5.1 | v44.96,39.62 44.96,40.54 C13.1 | v48.01,11.12 47.09,11.12 C15.1 | v52.43,12.04 52.58,12.04 53.34,11.28 C16.1
  Bottom 0.305: v56.24,33.07 57.98,33.07 C35.2 | C36.2 v70.71,22.71 | C34.2 68.7,30.66 v67.36,32 | C33.2 79.1,33.38 79.55,32.92 v79.55,31.85
  pour Route2: 0,56.39 87.17,56.39 87.17,0 0,0
HPA_A  (via drill 0.25)
  Top 0.254: v35.36,30.33 35.36,31.39 34.59,32.16 ADV7611.1 | v37.95,30.48 38.1,30.63 v38.1,37.19 | v43.74,43.13 43.43,43.43 43.43,47.85 U$1.19
  Bottom 0.254: v35.36,30.33 35.51,30.48 v37.95,30.48 | v38.1,37.19 38.1,40.35 arc-90 40.27,42.52 43.13,42.52 v43.74,43.13
HS  (via drill 0.25)
  Top 0.254: v43.59,13.41 43.59,15.39 42.05,16.93 arc45 41.71,17.07 37.8,17.07 37.49,17.37 37.49,18.59 36.73,19.36 36.73,20.69 arc90 35.63,21.79 33.83,21.79 33.53,21.49 33.53,21.03 ADV7611.46
  Bottom 0.254: v43.59,13.41 36.42,6.25 8.23,6.25 6.71,7.77 4.88,7.77 3.81,6.71 J2.3
LLC
  Top 0.254: J2.40 7.77,50.9 7.77,22.4 10.67,19.51 10.67,8.38 15.24,3.81 R31.1
LRCLK
  Bottom 0.254: R4.2 11.89,18.75 10.67,19.96 7.39,19.96 arc-45 7,20.12 6.53,20.6 arc45 5.85,20.88 5.16,20.88 arc-45 4.68,21.08 3.81,21.95 J2.15
MCLK
  Bottom 0.254: R5.2 11.89,16.31 9.91,18.29 4.88,18.29 3.81,19.36 J2.13
N$1
  Top 0.254: ADV7611.25 25.15,26.36 25.76,26.36 25.91,26.21 25.91,20.42 23.01,17.53 23.01,11.58 22.71,11.28 21.44,11.28 arc90 20.57,10.41 20.57,7.32 17.07,3.81 R31.2
N$2
  Top 0.254: R1.2 63.86,9.45 63.86,15.24 1.8V_D.K
N$3
  Top 0.254: R2.2 76.05,9.3 76.05,15.09 3.3V_D.K
N$4  (via drill 0.25)
  Top 0.254: ADV7611.49 37.48,22.87 38.1,22.25 v38.1,17.68
  Bottom 0.254: v38.1,17.68 38.1,10.21 35.66,7.77 24.84,7.77 17.37,15.24 17.37,17.46 R3.1
N$5  (via drill 0.25)
  Top 0.254: ADV7611.50 38.05,23.37 39.01,22.4 39.01,18.59 39.93,17.68 42.22,17.68 v42.98,16.92
  Bottom 0.254: v42.98,16.92 42.98,14.48 35.81,7.32 24.54,7.32 16.76,15.09 16.76,15.63 R4.1
N$6  (via drill 0.25)
  Top 0.254: ADV7611.51 38.46,23.87 39.93,22.4 39.93,18.9 40.39,18.44 43.13,18.44 v43.89,17.68
  Bottom 0.254: v43.89,17.68 43.89,14.63 35.97,6.71 24.38,6.71 16.15,14.94 15.02,14.94 R5.1
N$7  (via drill 0.25)
  Top 0.254: v40.84,38.56 40.84,29.78 arc-90 39.87,28.8 36.58,28.8 ADV7611.61 | v42.52,39.32 43.13,39.93 43.13,40.39 R6.1
  Bottom 0.254: v40.84,38.56 41.6,39.32 v42.52,39.32
N$8
  Top 0.254: ADV7611.39 30.04,17.82 33.53,14.33 35.36,14.33 35.97,13.72 35.97,11.97 R10.1
N$9
  Top 0.254: ADV7611.38 29.54,17.56 33.53,13.56 33.53,12.13 R11.1
N$10
  Top 0.254: ADV7611.37 29.04,17.3 31.39,14.94 31.39,12.08 R12.1
N$11
  Top 0.254: ADV7611.36 28.54,16.42 29.11,15.85 29.11,12.13 R13.1
N$12
  Top 0.254: ADV7611.35 28.04,17.06 26.67,15.7 26.67,11.97 R14.1
N$14  (via drill 0.25)
  Top 0.254: ADV7611.54 37.56,25.37 v37.95,25.76 | v46.18,20.57 52.73,20.57 53.34,19.96 v53.34,18.75
  Bottom 0.254: v37.95,25.76 43.59,25.76 45.41,23.93 45.41,21.03 45.87,20.57 v46.18,20.57 | v53.34,18.75 53.34,16.7 R45.1
N$15  (via drill 0.25)
  Top 0.254: v43.74,18.75 43.74,18.9 41.76,18.9 40.54,20.12 40.54,24.84 36.58,24.84 ADV7611.53
  Bottom 0.254: v43.74,18.75 45.87,16.61 46.94,16.61 R44.1
N$16  (via drill 0.25)
  Top 0.254: v43.89,6.1 45.87,6.1 R46.1
  Bottom 0.254: v43.89,6.1 41.76,3.96 32.16,3.96 32,3.81 7.92,3.81 7.33,4.4 arc-45 7.32,4.45 arc90 6.43,5.33 3.66,5.33 2.59,6.4 2.59,28.68 arc-90 3.48,29.57 J2.21
N$18
  Top 0.254: ADV7611.32 22.05,19.78 R16.2
N$19
  Top 0.254: ADV7611.31 24.28,23.37 19.66,18.75 19.66,12.13 R17.2
N$20
  Top 0.254: ADV7611.30 23.87,23.87 18.29,18.29 18.29,14.63 17.37,13.72 17.37,12.08 R18.2
N$21
  Top 0.254: R19.2 23.14,24.37 ADV7611.29
N$22
  Top 0.254: R20.2 21.3,24.87 ADV7611.28
N$23
  Top 0.254: R21.2 19.46,25.37 ADV7611.27
N$24
  Top 0.254: R22.2 17.63,25.87 ADV7611.26
N$25
  Top 0.254: R23.2 17.29,27.87 ADV7611.22
N$26
  Top 0.254: R24.2 17.44,28.37 ADV7611.21
N$27
  Top 0.254: R25.2 19.17,28.87 ADV7611.20
N$28
  Top 0.254: R26.2 20.91,29.37 ADV7611.19
N$29
  Top 0.254: R27.2 22.64,29.87 ADV7611.18
N$30
  Top 0.254: R28.2 24.38,30.37 ADV7611.17
N$44
  Top 0.254: ADV7611.16 26.39,32.92 22.55,32.92 20.98,34.49 R29.2
N$45
  Top 0.254: R30.2 22.4,35.88 22.4,33.83 22.86,33.38 27.13,33.38 27.54,32.97 ADV7611.15
N$48
  Top 0.254: ADV7611.33 24.43,18.37 R15.1
N$49
  Top 0.254: ADV7611.41 31.04,17.73 33.53,15.24 37.49,15.24 38.25,14.48 38.25,11.97 R9.1
N$51
  Top 0.254: ADV7611.42 31.54,18.15 33.68,16 39.47,16 40.54,14.94 40.54,11.97 R8.1
N$52
  Top 0.254: ADV7611.43 32.03,18.56 33.98,16.61 41.76,16.61 42.98,15.39 42.98,11.97 R7.1
P0  (via drill 0.25)
  Top 0.254: v36.27,3.35 42.98,10.06 R7.2
  Bottom 0.254: v36.27,3.35 7.01,3.35 6.25,4.12 J2.2
P1  (via drill 0.25)
  Top 0.254: v36.27,5.64 36.27,5.79 40.54,10.06 R8.2
  Bottom 0.254: v36.27,5.64 35.66,5.03 8.23,5.03 6.55,6.71 J2.4
P2
  Top 0.254: R9.2 38.25,10.06 30.18,1.98 5.8,1.98 arc-90 4.72,3.06 4.72,4.57 3.76,5.54 arc45 3.52,5.64 3.24,5.64 arc-90 2.59,6.29 2.59,8.08 3.66,9.14 J2.5
P3  (via drill 0.25)
  Top 0.254: v31.39,5.64 35.97,10.21 R10.2 | v16,7.62 v17.98,5.64
  Bottom 0.254: v17.98,5.64 v31.39,5.64 | v16,7.62 14.48,9.14 6.25,9.14 J2.6
P4  (via drill 0.25)
  Top 0.254: v27.74,4.42 33.53,10.21 R11.2 | v8.23,4.42 7.01,5.64 5.7,5.64 arc-90 4.72,6.62 4.72,10.82 3.81,11.73 J2.7
  Bottom 0.254: v8.23,4.42 v27.74,4.42
P5  (via drill 0.25)
  Top 0.254: v22.55,7.62 28.65,7.62 31.24,10.21 R12.2
  Bottom 0.254: v22.55,7.62 20.42,9.75 8.23,9.75 6.25,11.73 J2.8
P6  (via drill 0.25)
  Top 0.254: v23.16,7.01 29.57,7.01 32.16,9.6 32.16,10.78 arc90 31.82,11.12 30.63,11.12 30.33,10.82 arc-90 29.87,10.36 29.11,10.36 R13.2
  Bottom 0.254: v23.16,7.01 8.08,7.01 6.86,8.23 5.79,8.23 4.72,9.3 4.72,13.31 arc90 J2.9
P7  (via drill 0.25)
  Top 0.254: v25.6,11.43 26.67,10.36 R14.2
  Bottom 0.254: v25.6,11.43 22.1,14.94 21.49,14.94 14.33,22.1 13.11,22.1 12.8,21.79 12.8,15.73 arc-90 11.4,14.33 J2.10
P8  (via drill 0.25)
  Top 0.254: v4.57,20.27 4.72,20.12 4.72,17.16 arc90 6.04,15.85 arc-45 6.4,15.7 8.84,13.26 8.84,3.52 arc90 9.92,2.44 17.83,2.44 21.49,6.1 21.49,7.58 arc-90 22.14,8.23 22.4,8.23 24.38,10.21 R15.2
  Bottom 0.254: v4.57,20.27 5.33,19.51 6.25,19.51 J2.14
P9  (via drill 0.25)
  Top 0.254: v10.52,20.57 11.12,19.96 11.12,10.36 16.15,5.33 16.15,3.11 arc90 16.37,2.9 17.68,2.9 21.03,6.25 21.03,9.45 21.95,10.36 R16.1
  Bottom 0.254: v10.52,20.57 9.14,21.95 J2.16
P10  (via drill 0.25)
  Top 0.254: v8.38,24.08 8.38,23.93 11.58,20.73 11.58,12.65 arc90 13.11,11.12 18.14,11.12 18.29,10.97 arc90 18.75,10.52 19.66,10.52 R17.1
  Bottom 0.254: v8.38,24.08 8.08,24.38 6.25,24.38 J2.18
P11  (via drill 0.25)
  Top 0.254: v16.31,10.36 17.37,10.36 R18.1 | v10.06,12.65 7.32,15.39 7.32,25.91 6.25,26.98 J2.20
  Bottom 0.254: v16.31,10.36 14.02,12.65 v10.06,12.65
P12  (via drill 0.25)
  Top 0.254: v9.3,26.52 9.3,23.62 14.94,17.98 R19.1
  Bottom 0.254: v9.3,26.52 J2.22
P13  (via drill 0.25)
  Top 0.254: v12.5,25.76 12.5,22.71 14.94,20.27 R20.1
  Bottom 0.254: v12.5,25.76 6.25,32 J2.24
P14  (via drill 0.25)
  Top 0.254: v13.41,27.43 13.41,23.93 14.78,22.55 R21.1
  Bottom 0.254: v13.41,27.43 6.25,34.59 J2.26
P15  (via drill 0.25)
  Top 0.254: v14.78,25.91 14.78,24.84 R22.1
  Bottom 0.254: v14.78,25.91 14.78,35.28 arc90 12.87,37.19 J2.28
P16  (via drill 0.25)
  Top 0.254: v15.39,28.19 15.39,27.58 14.94,27.13 R23.1
  Bottom 0.254: v15.39,28.19 15.39,37.27 arc90 13.96,38.71 5.79,38.71 4.95,39.55 arc-45 4.72,40.09 4.72,41.33 arc90 3.84,42.22 3.81,42.22 J2.31
P17  (via drill 0.25)
  Top 0.254: v8.38,40.39 8.38,35.66 14.63,29.41 R24.1
  Bottom 0.254: v8.38,40.39 6.55,42.22 6.25,42.22 J2.32
P18  (via drill 0.25)
  Top 0.254: v13.72,32.61 14.63,31.7 R25.1
  Bottom 0.254: v13.72,32.61 10.21,36.12 3.05,36.12 2.13,37.03 2.13,43.73 arc-90 3.21,44.81 J2.33
P19  (via drill 0.25)
  Top 0.254: v9.3,43.89 9.3,39.32 14.63,33.98 R26.1
  Bottom 0.254: v9.3,43.89 8.38,44.81 J2.34
P20  (via drill 0.25)
  Top 0.254: v15.39,43.89 15.39,37.03 14.63,36.27 R27.1
  Bottom 0.254: v15.39,43.89 10.82,48.46 4.88,48.46 3.81,47.4 J2.35
P21  (via drill 0.25)
  Top 0.254: v8.38,46.33 13.87,40.84 13.87,39.17 14.48,38.56 R28.1
  Bottom 0.254: v8.38,46.33 7.47,47.24 6.25,47.24 J2.36
P22
  Top 0.254: R29.1 21.03,38.56 21.95,38.56 arc-90 22.55,37.95 22.71,37.8 24.17,37.8 arc90 24.38,38.01 24.38,39.17 9.6,53.95 5.49,53.95 arc90 4.72,53.19 4.72,50.9 J2.37
P23
  Top 0.254: R30.1 23.32,38.71 23.01,38.71 8.23,53.49 5.83,53.49 arc90 5.18,52.85 5.18,51.05 6.25,49.99 J2.38
RESET
  Top 0.254: 67.51,6.86 67.51,8.53 U$3.2 | 67.51,6.86 67.51,2.13 U$3.1 | ADV7611.56 36.58,26.36 39.8,26.36 arc-90 41,25.18 41,20.27 41.91,19.36 44.68,19.36 arc-90 45.87,18.16 45.87,7.92 R46.2 46.02,7.77 46.79,7.01 46.79,6.86 67.51,6.86
RXA_0+  (via drill 0.25)
  Top 0.254: 37.42,45.72 37.42,40.77 31.55,34.9 31.55,32.28 ADV7611.7 | 37.42,45.72 U$1.7 | v50.75,53.34 50.75,54.41 R34.1 | 37.42,45.72 v37.8,45.72
  Bottom 0.254: v37.8,45.72 49.1,45.72 arc90 50.75,47.37 v50.75,53.34
RXA_0-  (via drill 0.25)
  Top 0.254: ADV7611.6 32.03,34.32 38.41,40.69 38.41,47.84 U$1.9 38.41,47.85 38.41,49.07 v38.71,49.38 | v49.68,51.97 50.75,51.97 R35.1
  Bottom 0.254: v49.68,51.97 48.31,50.6 39.93,50.6 v38.71,49.38
RXA_1+  (via drill 0.25)
  Top 0.254: ADV7611.10 30.04,35.67 35.97,41.6 35.97,45.72 | 35.97,45.72 35.97,47.8 U$1.4 | v30.18,45.72 30.18,48.16 26.98,51.36 R38.2 | 35.97,45.72 v36.12,45.72
  Bottom 0.254: v36.12,45.72 v30.18,45.72
RXA_1-  (via drill 0.25)
  Top 0.254: ADV7611.9 30.54,35.26 36.88,41.6 36.88,47.82 U$1.6 36.88,47.85 36.88,49.23 v37.03,49.38 | v28.04,53.95 26.98,53.95 R39.2
  Bottom 0.254: v28.04,53.95 31.39,50.6 35.81,50.6 v37.03,49.38
RXA_2+
  Top 0.254: ADV7611.13 28.54,36.31 32.54,40.31 | 32.54,40.31 34.44,42.22 34.44,47.83 U$1.1 | R36.2 26.82,46.02 32.54,40.31
RXA_2-  (via drill 0.25)
  Top 0.254: ADV7611.12 29.04,35.59 35.42,41.97 35.42,46.33 | 35.42,46.33 U$1.3 | v28.04,48.77 26.98,48.77 R37.2 | 35.42,46.33 v35.05,46.33
  Bottom 0.254: v28.04,48.77 30.48,46.33 v35.05,46.33
RXA_5V  (via drill 0.25)
  Top 0.254: v36.73,35.66 36.73,30.63 36.58,30.48 ADV7611.64 | v42.52,37.95 44.35,39.78 44.35,48.46 43.59,49.23 43.19,49.23 arc90 42.98,49.01 42.98,47.85 U$1.18
  Route2 0.254: v36.73,35.66 37.95,35.66 v38.71,36.42
  Bottom 0.254: v38.71,36.42 40.23,37.95 v42.52,37.95
RXA_C+  (via drill 0.25)
  Top 0.254: 38.92,46.33 38.92,40.44 33.07,34.59 33.07,32.3 ADV7611.4 | 38.92,46.33 U$1.10 | v50.14,48.46 50.14,49.07 50.6,49.53 R32.1 | 38.92,46.33 v39.17,46.33
  Bottom 0.254: v50.14,48.46 48.01,46.33 v39.17,46.33
RXA_C-
  Top 0.254: ADV7611.3 33.53,34.14 39.92,40.53 U$1.12 39.93,49.43 arc-90 41.55,51.05 48.46,51.05 48.77,50.75 48.77,48.92 50.44,47.24 R33.1
SCL
  Bottom 0.254: 47.09,14.48 47.09,14.78 R44.2 47.09,14.48 | 47.09,14.48 47.09,12.95 C15.2 46.94,12.8 44.5,10.36 44.5,4.25 arc-90 42.38,2.13 4.27,2.13 2.13,4.27 2.13,33.07 arc-90 3.66,34.59 J2.25 | 47.09,14.48 49.99,14.48 R43.1
SCLK
  Bottom 0.254: R3.2 11.89,21.18 9.6,23.47 4.72,23.47 J2.17
SDA
  Bottom 0.254: 53.49,14.48 53.49,14.94 R45.2 53.49,14.48 | 53.49,14.48 53.49,12.95 C16.2 | 54.86,14.48 53.49,14.48 | 54.86,14.48 56.24,14.48 R42.1 | 54.86,14.48 54.86,40.71 arc90 51.84,43.74 42.82,43.74 42.22,44.35 27.13,44.35 26.06,43.28 3.2,43.28 2.59,42.67 2.59,38.28 arc90 3.69,37.19 J2.27
V+  (via drill 0.25)
  Top 0.305: v59.89,31.7 61.19,31.7 1.8V_REG.3 | v72.24,32 73.58,32 3.3V_REG.3
  Top 0.61: 68.02,40.03 U$4.1 | 68.02,40.03 73.76,34.29 73.76,31.83 3.3V_REG.3 | 1.8V_REG.3 61.54,33.55 68.02,40.03
  Bottom 0.305: C35.1 59.83,31.76 v59.89,31.7 | C33.1 72.85,33.38 72.24,32.77 v72.24,32
VDD  (via drill 0.25)
  Top 0.254: ADV7611.2 34.03,31.34 v34.44,30.94 | ADV7611.14 28.04,33.99 27.58,34.44 v23.77,34.44 | ADV7611.24 25.86,26.87 26.67,26.06 v26.67,24.99 | ADV7611.40 30.54,22.2 v30.33,22.4 | ADV7611.52 35.34,24.37 v34.9,23.93 | ADV7611.57 34.95,26.87 v34.59,26.52 | ADV7611.60 35.79,28.37 v34.59,29.57
  Top 0.305: v60.81,23.77 61.77,23.77 1.8V_REG.4 63.86,17.88 1.8V_D.A | ADV7611.14 28.04,31.08 v27.74,30.79
  Route3 0.305: v60.81,23.77 56.69,19.66 v37.34,19.66
  Bottom 0.254: v34.44,30.94 36.34,30.94 C4.2 37.81,34.85 C3.2 | v23.77,34.44 22.19,34.44 | 22.19,34.44 C9.2 | 22.19,34.44 22.19,32.31 C10.2 | v26.67,24.99 22.29,24.99 C17.2 C18.2 | v30.33,22.4 30.33,18.22 C29.2 27.94,18.12 C30.2 | 37.8,19.66 39.43,19.66 | 39.43,19.66 C21.2 | 39.43,19.66 39.43,17.37 C22.2 | 35.2,24.99 39.03,24.99 C26.2 39.43,24.59 C25.2 | v34.59,29.57 39.23,29.57 | 39.23,29.57 C23.2 | 39.23,29.57 39.23,27.58 C24.2
  Bottom 0.305: 37.8,19.66 v37.34,19.66 34.9,22.1 | 34.9,22.1 v34.9,23.93 34.9,24.69 35.2,24.99 34.59,25.6 v34.59,26.52 v34.59,29.57 | v34.44,30.94 34.59,30.79 v34.59,29.57 | 34.9,22.1 33.83,23.16 31.09,23.16 v30.33,22.4 28.5,22.4 26.67,24.23 v26.67,24.99 27.74,26.06 | v34.59,29.57 34.44,29.72 31.39,29.72 27.74,26.06 | 27.74,26.06 v27.74,30.79 | C36.1 61.87,22.71 v60.81,23.77
VS  (via drill 0.25)
  Top 0.254: v33.98,19.96 33.98,20.88 ADV7611.47 | v38.71,15.39 39.32,14.78 39.32,9.6 33.68,3.96 32.77,3.96 30.33,1.52 4.79,1.52 arc-90 3.81,2.5 3.81,4.12 J2.1
  Bottom 0.254: v33.98,19.96 34.9,19.05 37.64,19.05 38.71,17.98 v38.71,15.39
XTALN
  Top 0.254: ADV7611.59 41.74,27.87 42.52,28.65 42.52,32.54 U$2.1 42.52,32.61 47.24,32.61 C1.1
XTALP
  Top 0.254: ADV7611.58 41.82,27.37 42.52,26.67 42.52,23.14 U$2.2 42.52,23.01 42.52,22.86 47.09,22.86 C2.1

### Text on the board
tDocu: HDMI_R ver 1.0 | Author: Cassandra Chow | Copyright DigiPen Inst. of Technology